# EAGLE schematic Sender (EAGLE 7.5.0)
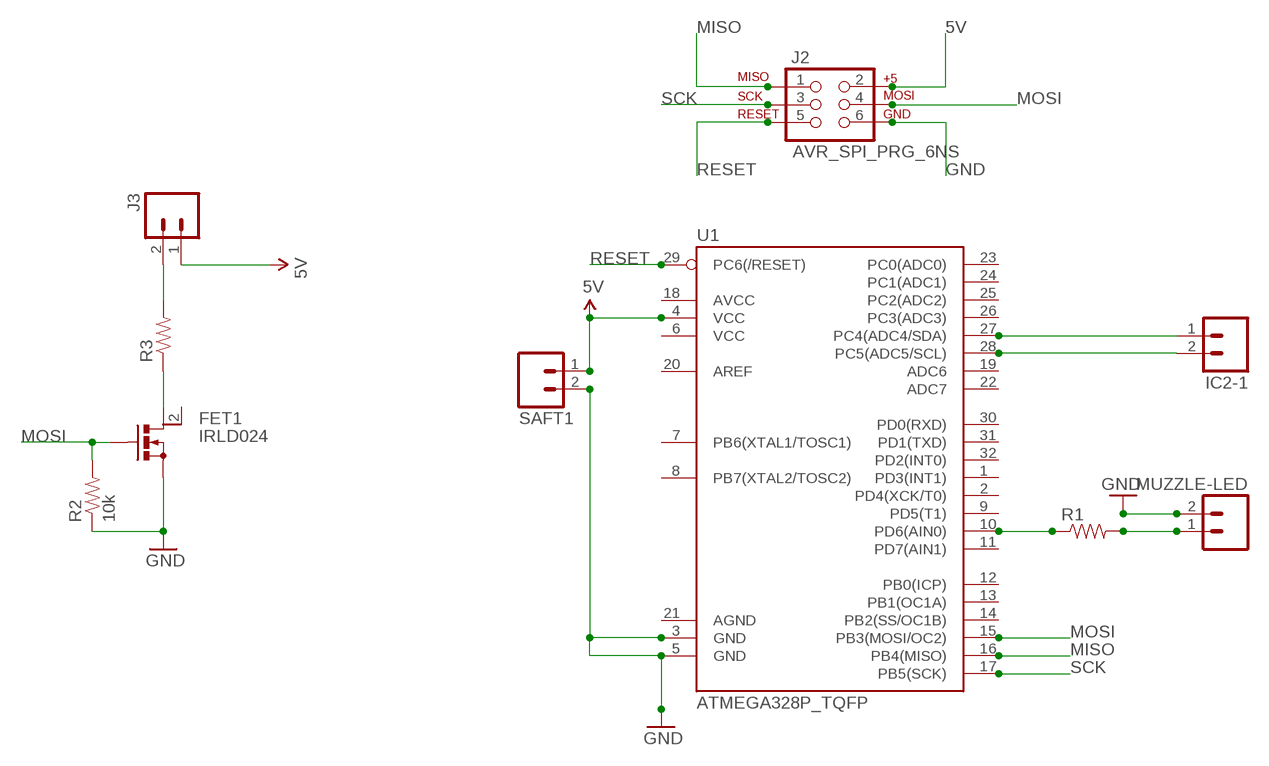
[diagram p0: schematic, sheet 1]

## Parts
FET1  IRLD024  [DIL04]
IC2-1  M02-JST-2-PTH-NO_SILK  [JST-2-PTH-NS]
J2  AVR_SPI_PRG_6NS  [2X3-NS]
J3  M02-JST-2-PTH-NO_SILK  [JST-2-PTH-NS]
MUZZLE-LED  M02-JST-2-PTH-NO_SILK  [JST-2-PTH-NS]
R1  RESISTOR0603-RES  [0603-RES]
R2  10k  RESISTOR0603-RES  [0603-RES]
R3  RESISTORPTH-2W  [AXIAL-0.8]
SAFT1  M02-JST-2-PTH-NO_SILK  [JST-2-PTH-NS]
U1  ATMEGA328P_TQFP  [TQFP32-08]

## Nets
5V: J2.2 J3.1 SAFT1.1 U1.4(VCC)
GND: FET1.4(S) J2.6 MUZZLE-LED.2 R2.1 SAFT1.2 U1.3(GND) U1.5(GND)
MISO: J2.1 U1.16(PB4(MISO))
MOSI: FET1.3(G) J2.4 R2.2 U1.15(PB3(MOSI/OC2))
N$1: IC2-1.1 U1.27(PC4(ADC4/SDA))
N$2: R1.1 U1.10(PD6(AIN0))
N$3: IC2-1.2 U1.28(PC5(ADC5/SCL))
N$4: MUZZLE-LED.1 R1.2
N$5: J3.2 R3.P$2
N$6: FET1.1(D1) R3.P$1
RESET: J2.5 U1.29(PC6(/RESET))
SCK: J2.3 U1.17(PB5(SCK))
Unconnected: FET1.2(D2) U1.1(PD3(INT1)) U1.2(PD4(XCK/T0)) U1.6(VCC) U1.7(PB6(XTAL1/TOSC1)) U1.8(PB7(XTAL2/TOSC2)) U1.9(PD5(T1)) U1.11(PD7(AIN1)) U1.12(PB0(ICP)) U1.13(PB1(OC1A)) U1.14(PB2(SS/OC1B)) U1.18(AVCC) U1.19(ADC6) U1.20(AREF) U1.21(AGND) U1.22(ADC7) U1.23(PC0(ADC0)) U1.24(PC1(ADC1)) U1.25(PC2(ADC2)) U1.26(PC3(ADC3)) U1.30(PD0(RXD)) U1.31(PD1(TXD)) U1.32(PD2(INT0))

## Library data of the parts
FET1 = IRLD024:IRLD024
IC2-1 J3 MUZZLE-LED SAFT1 = SparkFun-Connectors:M02: Standard 2-pin 0.1" header. Use with - straight break away headers ( PRT-00116) - right angle break away headers (PRT-00553) - swiss pins (PRT-00743) - machine pins (PRT-00117) - female headers (PRT-00115) Molex polarized connector foot print use with: PRT-08233 with associated crimp pins and housings. 2.54_SCREWTERM for use with PRT-10571. 3.5mm Screw Terminal footprints for PRT-08084 5mm Screw Terminal footprints for use with PRT-08432
J2 = SparkFun-Connectors:AVR_SPI_PRG_6: AVR ISP 6 Pin This is the reduced ISP connector for AVR programming. Common on Arduino. This footprint will take up less PCB space and can be used with a 10-pin to 6-pin adapter such as SKU: BOB-08508 **Special note about "TEST_POINT" package. The stop mask is on the top side, so if you want your programming test points to be on the bottom of your board, make sure to place this package on the bottom side of the board. This also ensure that the orientation to program from the bottom side will be correct.
R1-R3 = SparkFun-Resistors:RESISTOR: Resistor Basic schematic elements and footprints for 0603, 1206, and PTH resistors.
U1 = SparkFun-DigitalIC:ATMEGA328P_TQFP; PROD_ID: IC-09069